# Altium schematic sheet Load-Transient_Tool.SchDoc: Transient Load Tester
size 240 x 160 mm; Date: 12/05/2024; CompanyName: mastermind; DrawnBy: Yasir Shahzad; Organization: mastermind; Revision: 1.0; SheetNumber: 1; SheetTotal: 1
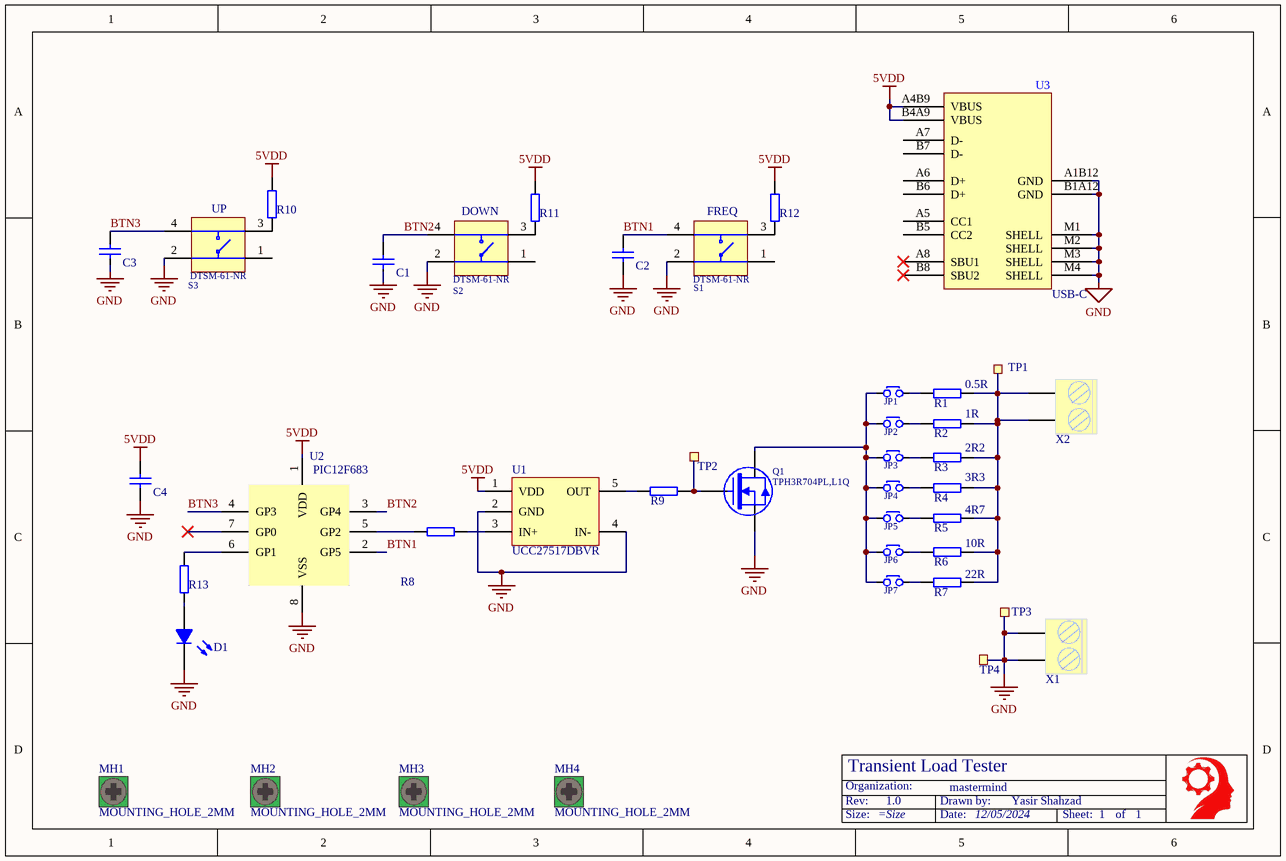
[diagram p0: Load-Transient_Tool.SchDoc]

## Parts
*  TitleBlock  (value not drawn)  (graphical)
C1  4.7nF  [C0603]  (value not drawn)
C2  4.7nF  [C0603]  (value not drawn)
C3  4.7nF  [C0603]  (value not drawn)
C4  N.C  [C0805]  (value not drawn)
D1  LED  [CHIPLED_0603]  (value not drawn)
JP1  Jumper, 2-Pin  [JUMPER-2PIN]  (value not drawn)
JP2  Jumper, 2-Pin  [JUMPER-2PIN]  (value not drawn)
JP3  Jumper, 2-Pin  [JUMPER-2PIN]  (value not drawn)
JP4  Jumper, 2-Pin  [JUMPER-2PIN]  (value not drawn)
JP5  Jumper, 2-Pin  [JUMPER-2PIN]  (value not drawn)
JP6  Jumper, 2-Pin  [JUMPER-2PIN]  (value not drawn)
JP7  Jumper, 2-Pin  [JUMPER-2PIN]  (value not drawn)
MH1  MOUNTING_HOLE_2MM  [MOUNTINGHOLE_2.5_PLATED]
MH2  MOUNTING_HOLE_2MM  [MOUNTINGHOLE_2.5_PLATED]
MH3  MOUNTING_HOLE_2MM  [MOUNTINGHOLE_2.5_PLATED]
MH4  MOUNTING_HOLE_2MM  [MOUNTINGHOLE_2.5_PLATED]
Q1  TPH3R704PL,L1Q  [POWERDI3333-8_L3.3-W3.3-P0.65-BL]
R1  0.5Ω  [R2512]  (value not drawn)
R2  1Ω  [R2512]  (value not drawn)
R3  2.2Ω  [R2512]  (value not drawn)
R4  3.3Ω  [R2512]  (value not drawn)
R5  4.7Ω  [R2512]  (value not drawn)
R6  10Ω  [R2512]  (value not drawn)
R7  22Ω  [R2512]  (value not drawn)
R8  470Ω  [R0603]  (value not drawn)
R9  47Ω  [R0603]  (value not drawn)
R10  4.7kΩ  [R0603]  (value not drawn)
R11  4.7kΩ  [R0603]  (value not drawn)
R12  4.7kΩ  [R0603]  (value not drawn)
R13  1kΩ  [R0603]  (value not drawn)
S1  DTSM-61-NR  [KEY-TH_4P-L6.2-W6.2-P4.50-LS6.5]
S2  DTSM-61-NR  [KEY-TH_4P-L6.2-W6.2-P4.50-LS6.5]
S3  DTSM-61-NR  [KEY-TH_4P-L6.2-W6.2-P4.50-LS6.5]
TP1  TP  [TP_TH_1MM_RED]  (value not drawn)  (no BOM)
TP2  TP  [TP_TH_1MM_YELLOW]  (value not drawn)  (no BOM)
TP3  TP  [TP_TH_1MM_BLACK]  (value not drawn)  (no BOM)
TP4  TP  [TP_TH_1MM_BLACK]  (value not drawn)  (no BOM)
U1  UCC27517DBVR  [SOT23-5L]
U2  PIC12F683  [DIL08-ROUND]
U3  USB C  [USB_C_CUSB31-CFM2AX-01-X]  (value not drawn)
X1  Terminal Block 3.5mmPitch: 3,5 mmNumber of pins: 2Created by Rembrandt Electronicswww.rembrandtelectronics.com  [SCREWTERMINAL-5MM-2]  (value not drawn)
X2  Terminal Block 3.5mmPitch: 3,5 mmNumber of pins: 2Created by Rembrandt Electronicswww.rembrandtelectronics.com  [SCREWTERMINAL-5MM-2]  (value not drawn)

## Nets
5VDD: C4.1 R10.1 R11.1 R12.1 U1.1(VDD) U2.1(VDD) U3.A4B9(VBUS) U3.B4A9(VBUS)
GND: C1.2 C2.2 C3.2 C4.2 D1.C(K) Q1.2(S) S1.2 S2.2 S3.2 TP3.1 TP4.1 U1.2(GND) U1.4(IN-) U2.8(VSS) U3.A1B12(GND) U3.B1A12(GND) U3.M1(SHELL) U3.M2(SHELL) U3.M3(SHELL) U3.M4(SHELL) X1.1 X1.2
BTN1: C2.1 S1.4 U2.2(GP5)
BTN2: C1.1 S2.4 U2.3(GP4)
BTN3: C3.1 S3.4 U2.4(GP3)
NetD1_A: D1.A R13.2
NetJP1_1: JP1.1 JP2.1 JP3.1 JP4.1 JP5.1 JP6.1 JP7.1 Q1.3(D)
NetJP1_2: JP1.2 R1.2
NetJP2_2: JP2.2 R2.2
NetJP3_2: JP3.2 R3.2
NetJP4_2: JP4.2 R4.2
NetJP5_2: JP5.2 R5.2
NetJP6_2: JP6.2 R6.2
NetJP7_2: JP7.2 R7.2
NetQ1_1: Q1.1(G) R9.1 TP2.1
NetR1_1: R1.1 R2.1 R3.1 R4.1 R5.1 R6.1 R7.1 TP1.1 X2.1 X2.2
NetR8_1: R8.1 U1.3(IN+)
NetR8_2: R8.2 U2.5(GP2)
NetR9_2: R9.2 U1.5(OUT)
NetR10_2: R10.2 S3.3
NetR11_2: R11.2 S2.3
NetR12_2: R12.2 S1.3
NetR13_1: R13.1 U2.6(GP1)

Not connected (* = marked no-connect by the designer): MH1 MOUNT(3); MH2 MOUNT(3); MH3 MOUNT(3); MH4 MOUNT(3); S1 1; S2 1; S3 1; U2 7(GP0)*; U3 A5(CC1) A6(D+) A7(D-) A8(SBU1)* B5(CC2) B6(D+) B7(D-) B8(SBU2)*

## Notes on the sheet
- (near S3) UP
- (near S2) DOWN
- (near S1) FREQ
- 0.5R
- (near R2) 1R
- (near R3) 2R2
- (near R4) 3R3
- (near R5) 4R7
- (near R6) 10R
- (near R7) 22R
- (in symbol TitleBlock) Organization:; Rev:; Drawn by:; Size:; Date:; Sheet:; of
- (in symbol USB_C) USB-C

## Library data of the parts
* = TitleBlock: Title Block for Schematic Sheets
C1-C3 = Cap_0603: Capacitor, X5R, ±10%, 6.3V; Part Number: C0603-N.C.; Manufacturer: N.A.; Artikkelnr Noca: 20069060; Datasheet: *; LatestRevisionDate: 2009-11-23; Pin Count: 2; Publisher: Nordic Semiconductor; Published: 2009-05-08; Value: 4.7nF; Volts: 6.3V; Supplier: *; Supplier part number: *; 2nd source Supplier: *; 2nd source part number: *; Footprint Doc: 0603; Artikkelnr Simpro: N.A.; Manufacturer Part Number: N.A.
C4 = Cap_0805: Capacitor, X5R, ±10%, 6.3V; Manufacturer: N.A.; Specification: X7R, ±10%, 16V; Value: N.C
D1 = LEDCHIP-LED0603: SMD lamp beads
JP1-JP7 = Jumper, 2-Pin_TH
MH1-MH4 = MOUNTING_HOLE_2.5MM_PLATED
Q1 = MOSFET-TPH3R704PL_1: N Channel Mosfet 40V 92A dfn-8
R1-R7 = Res_2512: Resistor; Specification: ±1%; Manufacturer: *
R8-R13 = Res_0603: Resistor, ±1%, 0.100W; Part Number: R0603-N.C.Ω; Manufacturer: N.A.; Note: Chip Res; Manufacturer Part Number: N.A.; Datasheet: *; Footprint Doc: 0603; LatestRevisionDate: 2009-05-08; Pin Count: 2; Publisher: Nordic Semiconductor; Published: 2009-05-08; Supplier: *; Supplier part number: *; 2nd source Supplier: *; 2nd source part number: *; Artikkelnr Noca: N.A.; Artikkelnr Simpro: N.A.
  R8: Value: 470Ω
  R9: Value: 47Ω
  R10-R12: Value: 4.7kΩ
  R13: Value: 1kΩ
S1-S3 = SW B3FS: SPNA SMD Keyboard Switch
TP1-TP4 = TESTPAD_TH: Testpoint, through hole; Part Number: Testpoint TH; Artikkelnr Noca: N.A.; Manufacturer: *; Manufacturer Part Number: *; Datasheet: *; Footprint Doc: TESTPAD-TH; LatestRevisionDate: 2009-12-12; Pin Count: 1; Publisher: Nordic Semiconductor; Published: 2009-12-12; Value: TP; Note: *; Supplier: *; Supplier part number: *; 2nd source Supplier: *; 2nd source part number: *; Artikkelnr Simpro: N.A.
U1 = UCC27517DBVR: Gate Drive ICs ROHS; Name: UCC27517DBVR
U3 = USB_C: USB Type-C USB 2.0 Connector; GateName_1: G$1; SymbolName_1: USB_C; LibraryName: adafruit_connector; DeviceSetName: USB_C
X1 X2 = SCREWTERMINAL-H2-5.0: GateName_1: -1; SymbolName_1: TERMINAL-BLOCK-PIN-3.5MM
U2 = PIC12F683: Name: PIC12F683